# EAGLE design ModMoPSS - IR sender (EAGLE 9.6.2)
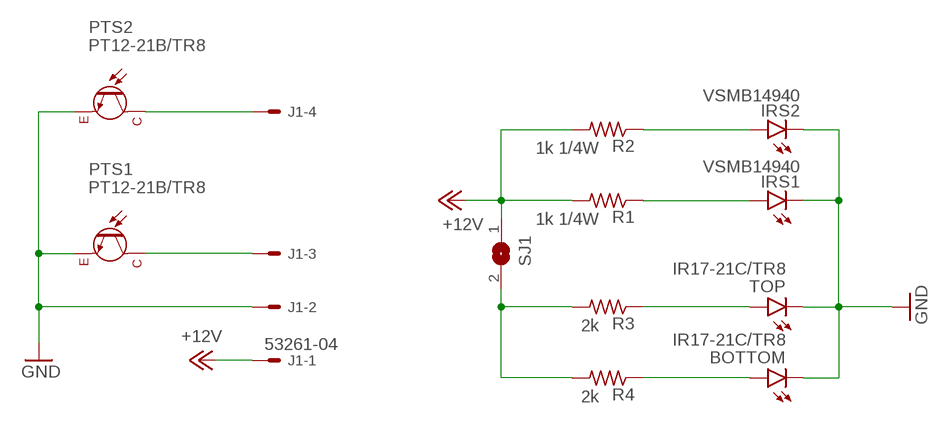
[diagram p0: schematic, sheet 1]

## Parts
BOTTOM  IR17-21C/TR8  LEDCHIP-LED0805  [CHIP-LED0805]
IRS1  VSMB14940  [VSMB14940]
IRS2  VSMB14940  [VSMB14940]
J1  53261-04  [53261-04]
PTS1  PT12-21B/TR8  [PT12-21B/TR8]
PTS2  PT12-21B/TR8  [PT12-21B/TR8]
R1  1k 1/4W  R-US_R0805  [R0805]
R2  1k 1/4W  R-US_R0805  [R0805]
R3  2k  R-US_R0805  [R0805]
R4  2k  R-US_R0805  [R0805]
SJ1  SJ  [SJ]
TOP  IR17-21C/TR8  LEDCHIP-LED0805  [CHIP-LED0805]

## Nets
+12V: J1.1 R1.2 R2.2 SJ1.1
GND: BOTTOM.C IRS1.P$2(C) IRS2.P$2(C) J1.2 PTS1.P$2(E) PTS2.P$2(E) TOP.C
N$1: J1.3 PTS1.P$1(C)
N$2: IRS2.P$1(A) R2.1
N$3: BOTTOM.A R4.1
N$4: R3.1 TOP.A
N$5: J1.4 PTS2.P$1(C)
N$6: R3.2 R4.2 SJ1.2
N$7: IRS1.P$1(A) R1.1

## Library data of the parts
BOTTOM TOP = led:LED: LED OSRAM: - CHIPLED LG R971, LG N971, LY N971, LG Q971, LY Q971, LO R971, LY R971 LH N974, LH R974 LS Q976, LO Q976, LY Q976 LO Q996 - Hyper CHIPLED LW Q18S LB Q993, LB Q99A, LB R99A - SideLED LS A670, LO A670, LY A670, LG A670, LP A670 LB A673, LV A673, LT A673, LW A673 LH A674 LY A675 LS A676, LA A676, LO A676, LY A676, LW A676 LS A679, LY A679, LG A679 - Hyper Micro SIDELED® LS Y876, LA Y876, LO Y876, LY Y876 LT Y87S - SmartLED LW L88C, LW L88S LB L89C, LB L89S, LG L890 LS L89K, LO L89K, LY L89K LS L896, LA L896, LO L896, LY L896 - TOPLED LS T670, LO T670, LY T670, LG T670, LP T670 LSG T670, LSP T670, LSY T670, LOP T670, LYG T670 LG T671, LOG T671, LSG T671 LB T673, LV T673, LT T673, LW T673 LH T674 LS T676, LA T676, LO T676, LY T676, LB T676, LH T676, LSB T676, LW T676 LB T67C, LV T67C, LT T67C, LS T67K, LO T67K, LY T67K, LW E67C LS E67B, LA E67B, LO E67B, LY E67B, LB E67C, LV E67C, LT E67C LW T67C LS T679, LY T679, LG T679 LS T770, LO T770, LY T770, LG T770, LP T770 LB T773, LV T773, LT T773, LW T773 LH T774 LS E675, LA E675, LY E675, LS T675 LS T776, LA T776, LO T776, LY T776, LB T776 LHGB T686 LT T68C, LB T68C - Hyper Mini TOPLED® LB M676 - Mini TOPLED Santana® LG M470 LS M47K, LO M47K, LY M47K Source: http://www.osram.convergy.de LUXEON: - LUMILED® LXK2-PW12-R00, LXK2-PW12-S00, LXK2-PW14-U00, LXK2-PW14-V00 LXK2-PM12-R00, LXK2-PM12-S00, LXK2-PM14-U00 LXK2-PE12-Q00, LXK2-PE12-R00, LXK2-PE12-S00, LXK2-PE14-T00, LXK2-PE14-U00 LXK2-PB12-K00, LXK2-PB12-L00, LXK2-PB12-M00, LXK2-PB14-N00, LXK2-PB14-P00, LXK2-PB14-Q00 LXK2-PR12-L00, LXK2-PR12-M00, LXK2-PR14-Q00, LXK2-PR14-R00 LXK2-PD12-Q00, LXK2-PD12-R00, LXK2-PD12-S00 LXK2-PH12-R00, LXK2-PH12-S00 LXK2-PL12-P00, LXK2-PL12-Q00, LXK2-PL12-R00 Source: www.luxeon.com KINGBRIGHT: KA-3528ASYC Source: www.kingbright.com
IRS1 IRS2 = 000-my_library:VSMB14940
J1 = con-molex:53?-04: CONNECTOR wire to board 1.25 mm (.049 inch) pitch header; MF: MOLEX; OC_FARNELL: 1125374; OC_NEWARK: unknown
PTS1 PTS2 = 000-my_library:PT12-21B/TR8
R1-R4 = rcl:R-US_: RESISTOR, American symbol; SPICEPREFIX: R
SJ1 = jumper:SJ: SMD solder JUMPER

## Board
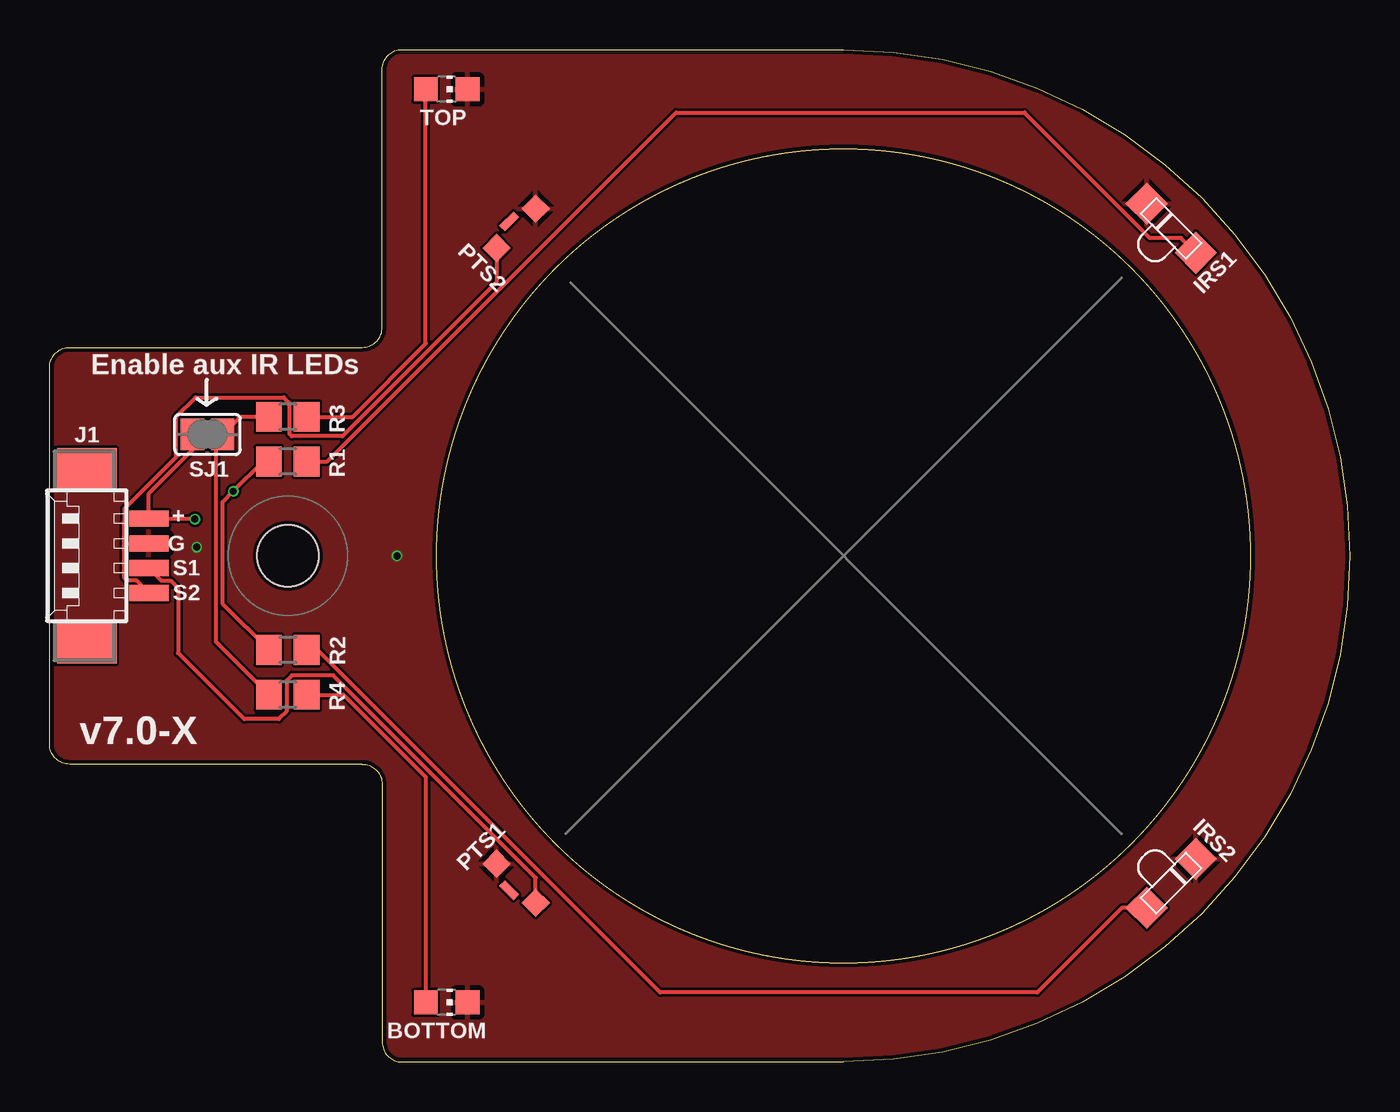
[diagram p1: board, top side]
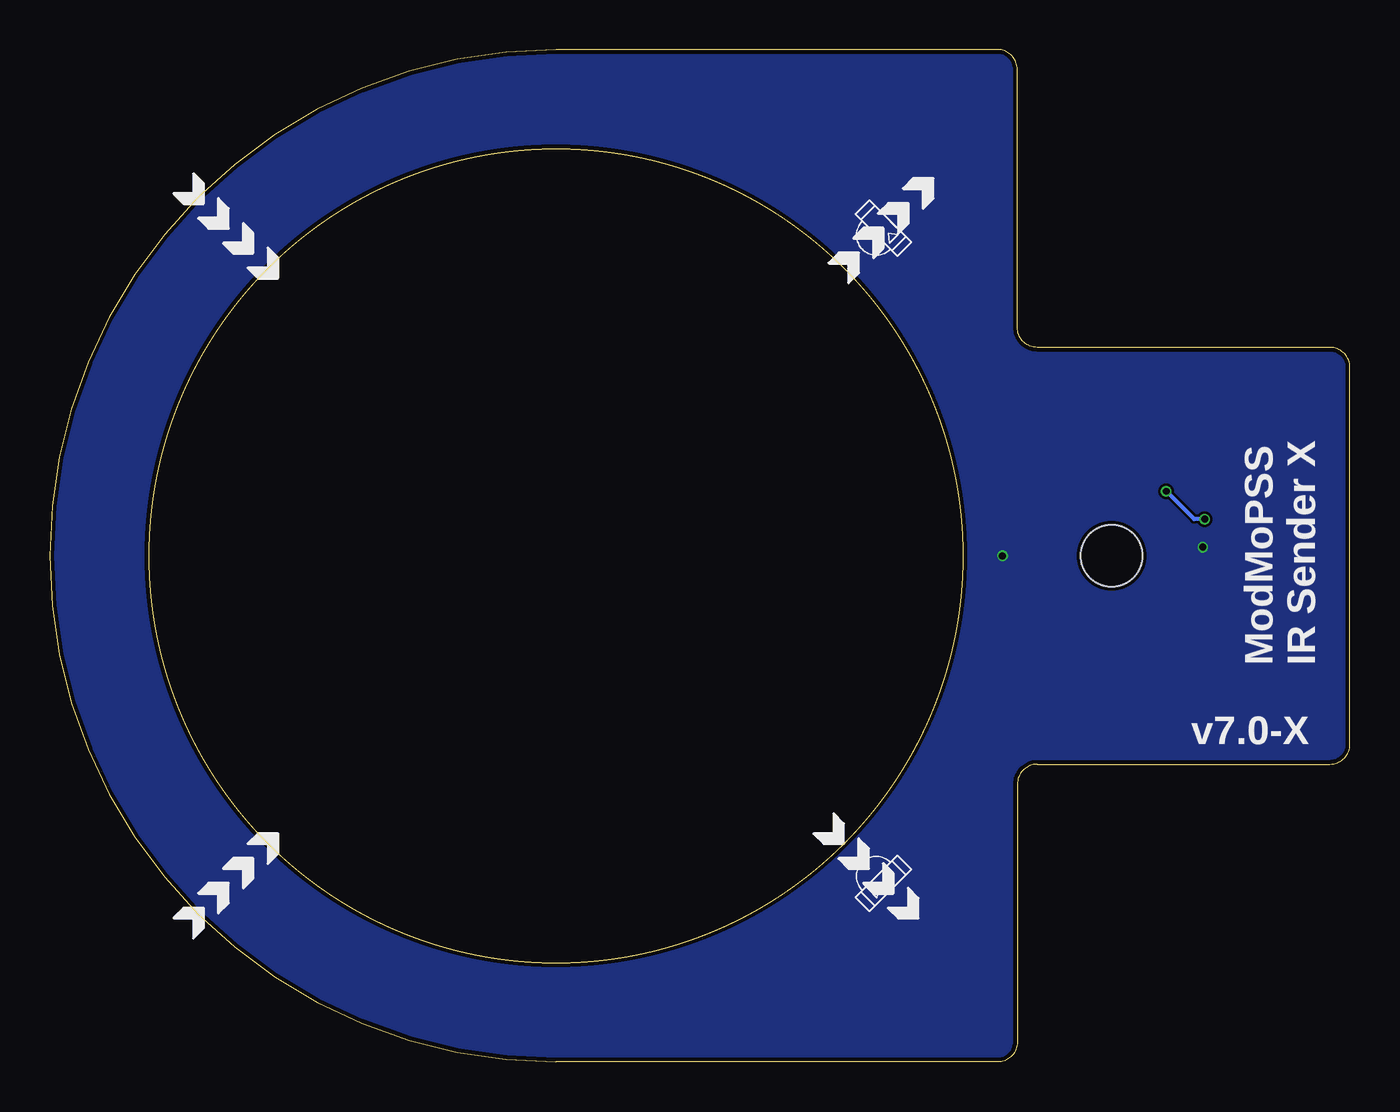
[diagram p2: board, bottom side, seen from below]

Size 65.5 x 51 mm. Coordinates in mm from the lower left corner, seen from the top.
Outline: 15.75,15 1,15 arc-90 0,16 0,35 arc-90 1,36 15.75,36 arc90 16.75,37 16.75,50 arc-90 17.75,51 40,51 arc-180 40,0 17.75,0 arc-90 16.75,1 16.75,14 arc90 15.75,15
Outline: circle at 40,25.5 radius 20.5
Copper layers (1*16): Top 0.035559375mm / dielectric 1.6mm / Bottom 0.035559375mm
Design rules "jlcpcb2layer": minimum track width 5mil, minimum drill 12mil, track to track 5mil, track to pad 5mil, pad to pad 5mil, via to via 5mil, smd to smd 5mil, copper to edge 8mil, drill to drill 6mil, minimum pad ring 5mil, minimum via ring 3mil, stop-mask expansion 2.5mil, vias tented up to drill 0mil, thermal gap 10mil
Holes 3.1 mm at 12,25.5

### Footprints (pad centres in the part's own frame; a part is rotated, then mirrored left to right if it is on the bottom)
CHIP-LED0805 = smd 1.2 x 1.2: A 0,-1.05; C 0,1.05
VSMB14940 = smd 1.5 x 1.5: P$1 -1.75,0; P$2 1.75,0
53261-04 = smd 0.8 x 2: 1 1.875,-2.5; 2 0.625,-2.5; 3 -0.625,-2.5; 4 -1.875,-2.5 | smd 2.1 x 3: S1 4.375,0.625; S2 -4.375,0.625
PT12-21B/TR8 = smd 1 x 1: P$1 1.4,0; P$2 -1.4,0 | smd 1 x 0.4: P$3 0,-0.5
R0805 = smd 1.3 x 1.5: 1 -0.95,0; 2 0.95,0
SJ = smd 1.168 x 1.6: 1 -0.762,0; 2 0.762,0

### Placement (x,y rotation side)
BOTTOM  20,3 270 top
IRS1  56.5,42 135 top
IRS2  56.5,9 45 top
J1  2.5,25.5 90 top
PTS1  23.5,9 315 top
PTS2  23.5,42 225 top
R1  12,30.25 180 top
R2  12,20.75 180 top
R3  12,32.5 180 top
R4  12,18.5 180 top
SJ1  7.95,31.61 0 top
TOP  20,49 270 top

### Tracks (layer width: path | path; a pad name or v marks a point on that pad's centre or on a via)
+12V  (via drill 0.35)
  Top 0.203: SJ1.1 7.19,30.82 5,28.62 J1.1 7.28,27.38 v7.32,27.34 | R1.2 10.75,30.25 v9.25,28.75 8.7,28.2 8.7,23.11 R2.2
  Bottom 0.203: v7.32,27.34 7.84,27.34 v9.25,28.75
GND  (via drill 0.35)
  other vias: 7.41,25.93 17.5,25.5
  pour Bottom: 66.5,-1.5 -0.74,-1.5 -0.74,52 66.5,52
  pour Top: 67,-2 -1.56,-2 -1.56,52.5 67,52.5
N$1
  Top 0.203: J1.3 5.62,24.25 6.09,24.25 6.47,23.87 6.47,20.6 9.8,17.27 11.54,17.27 11.93,17.66 11.93,19.2 12.21,19.48 14.29,19.48 24.49,9.28 PTS1.P$1
N$2
  Top 0.203: R2.1 13.5,20.75 30.75,3.5 49.75,3.5 54.01,7.76 IRS2.P$1
N$3
  Top 0.203: R4.1 14.8,18.5 18.95,14.35 BOTTOM.A
N$4
  Top 0.203: R3.1 15.26,32.5 18.95,36.19 TOP.A
N$5
  Top 0.203: J1.4 4.38,24.25 3.9,24.25 3.77,24.38 3.77,27.25 3.77,27.87 6.38,30.48 6.38,32.51 7.35,33.48 11.79,33.48 12.07,33.2 12.07,31.66 12.21,31.52 14.75,31.52 22.51,39.28 PTS2.P$1
N$6
  Top 0.203: R4.2 8.37,21.18 8.37,31.27 SJ1.2 9.6,32.5 R3.2
N$7
  Top 0.203: IRS1.P$1 56.99,41.51 55.43,41.51 49.12,47.83 31.56,47.83 13.98,30.25 R1.1

### Text on the board
tNames: Enable aux IR LEDs | + | G | S1 | S2 | v7.0-X
bNames: ModMoPSS / IR Sender X | v7.0-X